# EasyEDA Pro project MAX5864_REUSE.eprj, board PCB3
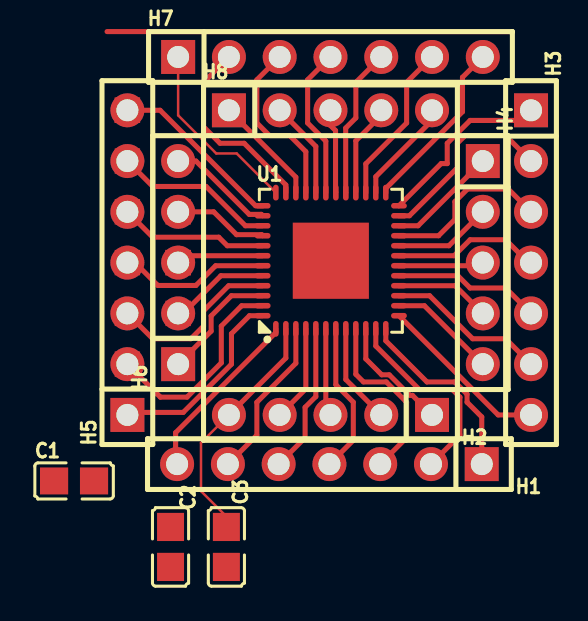
[diagram p8: board, top side]
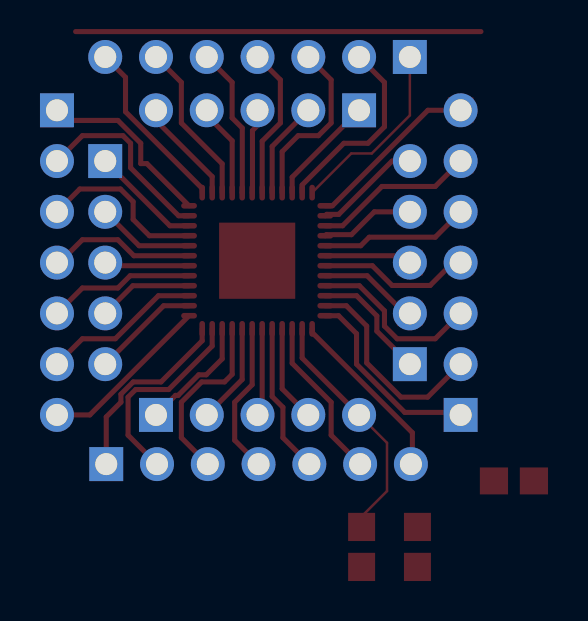
[diagram p9: board, bottom side, seen from below]

No outline. copper layers: Top Layer, Bottom Layer. Coordinates in mm from the lowest, leftmost part position.
Stack: Top Layer 0.035mm / Dielectric1 1.51mm FR4 er 4.5 / Bottom Layer 0.035mm

## Design rules (mm)
template: JLCPCB Capability(Two Layers Board)
spacing copperThickness1oz (default): track to track 0.102, other pairs 0.152 to 0.3
spacing copperThickness2oz: track to track 0.203, other pairs 0.152 to 0.3
track width copperThickness1oz (default): min 0.127, default 0.254, max 2.54
track width copperThickness2oz: min 0.203, default 0.254, max 2.54
differential pair differentialPair (default): width min 0.127, default 0.254, max 2.54; gap min 0.152, default 0.152
via viaSize (default): diameter min 0.5, default 0.61, max 10; hole min 0.3, default 0.305, max 6.3

## Placement (name value [footprint] x y rotation side)
C1  .33uF  [C0805]  0 3.3 0 top
C2  2.2u  [C0805]  4.83 0 270 top
C3  .1u  [C0805]  7.62 0 270 top
H1  -  [HDR-TH_7P-P2.54-V-M]  12.78 4.14 180 top
H2  -  [HDR-TH_5P-P2.54-V-M]  12.83 6.6 180 top
H3  -  [HDR-TH_7P-P2.54-V-M]  22.86 14.22 270 top
H4  -  [HDR-TH_5P-P2.54-V-M]  20.45 14.22 270 top
H5  -  [HDR-TH_7P-P2.54-V-M]  2.67 14.22 90 top
H6  -  [HDR-TH_5P-P2.54-V-M]  5.21 14.22 90 top
H7  -  [HDR-TH_7P-P2.54-V-M]  12.83 24.51 0 top
H8  -  [HDR-TH_5P-P2.54-V-M]  12.83 21.84 0 top
NOREF  -  [Pad_e391]  5.21 14.22 0 top
NOREF#2  -  [Pad_e380]  2.67 21.84 0 top
NOREF#3  -  [Pad_e382]  2.67 21.84 0 top
NOREF#4  -  [Pad_e387]  2.67 9.14 0 top
NOREF#5  -  [Pad_e383]  2.67 19.3 0 top
NOREF#6  -  [Pad_e384]  2.67 16.76 0 top
NOREF#7  -  [Pad_e388]  2.67 6.6 0 top
NOREF#8  -  [Pad_e392]  5.21 16.76 0 top
NOREF#9  -  [Pad_e385]  2.67 14.22 0 top
NOREF#10  -  [Pad_e389]  5.21 9.14 0 top
NOREF#11  -  [Pad_e386]  2.67 11.68 0 top
NOREF#12  -  [Pad_e390]  5.21 11.68 0 top
NOREF#13  -  [Pad_e381]  5.21 14.22 0 top
U1  MAX5864ETM+T  [qfn-48_l7.0-w7.0-p0.50-bl-ep5.6]  12.84 14.32 0 top

## Footprints (pads in the part's own frame, mm; a bottom-side part is the same pattern mirrored in y, then rotated)
C0805
  rect 1.41x1.35 smd: 1(-1,0) 2(1,0)
HDR-TH_5P-P2.54-V-M
  rect 1.7x1.7 hole 1.1: 1(-5.08,0)
  round 1.7 hole 1.1: 2(-2.54,0) 3(0,0) 4(2.54,0) 5(5.08,0)
HDR-TH_7P-P2.54-V-M
  rect 1.7x1.7 hole 1.1: 1(-7.62,0)
  round 1.7 hole 1.1: 2(-5.08,0) 3(-2.54,0) 4(0,0) 5(2.54,0) 6(5.08,0) 7(7.62,0)
Pad_e380
  rect 1.27x1.27 smd: 50(0,0)
Pad_e381
  rect 1.27x1.27 smd: 50(0,0)
Pad_e382
  rect 1.27x1.27 smd: 51(0,0)
Pad_e383
  rect 1.27x1.27 smd: 52(0,0)
Pad_e384
  rect 1.27x1.27 smd: 53(0,0)
Pad_e385
  rect 1.27x1.27 smd: 54(0,0)
Pad_e386
  rect 1.27x1.27 smd: 55(0,0)
Pad_e387
  rect 1.27x1.27 smd: 56(0,0)
Pad_e388
  rect 1.27x1.27 smd: 57(0,0)
Pad_e389
  rect 1.27x1.27 smd: 58(0,0)
Pad_e390
  rect 1.27x1.27 smd: 59(0,0)
Pad_e391
  rect 1.27x1.27 smd: 60(0,0)
Pad_e392
  rect 1.27x1.27 smd: 61(0,0)
qfn-48_l7.0-w7.0-p0.50-bl-ep5.6
  oval 0.28x0.79 smd: 1(-2.75,-3.408) 2(-2.25,-3.408) 3(-1.75,-3.408) 4(-1.25,-3.408) 5(-0.75,-3.408) 6(-0.25,-3.408) 7(0.25,-3.408) 8(0.75,-3.408) 9(1.25,-3.408) 10(1.75,-3.408) 11(2.25,-3.408) 12(2.75,-3.408) 25(2.75,3.408) 26(2.25,3.408) 27(1.75,3.408) 28(1.25,3.408) 29(0.75,3.408) 30(0.25,3.408) 31(-0.25,3.408) 32(-0.75,3.408) 33(-1.25,3.408) 34(-1.75,3.408) 35(-2.25,3.408) 36(-2.75,3.408)
  oval 0.79x0.28 smd: 13(3.408,-2.75) 14(3.408,-2.25) 15(3.408,-1.75) 16(3.408,-1.25) 17(3.408,-0.75) 18(3.408,-0.25) 19(3.408,0.25) 20(3.408,0.75) 21(3.408,1.25) 22(3.408,1.75) 23(3.408,2.25) 24(3.408,2.75) 37(-3.408,2.75) 38(-3.408,2.25) 39(-3.408,1.75) 40(-3.408,1.25) 41(-3.408,0.75) 42(-3.408,0.25) 43(-3.408,-0.25) 44(-3.408,-0.75) 45(-3.408,-1.25) 46(-3.408,-1.75) 47(-3.408,-2.25) 48(-3.408,-2.75)
  rect 3.81x3.81 smd: 49(0,0)

## Nets
0VDD: H4.3 U1.18
GND: C1.1 C2.2 C3.2 H1.1 H1.4 H1.5 H5.7 H6.3 NOREF.60 NOREF#2.50 NOREF#3.51 NOREF#13.50 U1.5 U1.7 U1.12 U1.37 U1.42 U1.49
VCC: C1.2 H1.7 U1.1
VDD: C2.1 C3.1 H1.2 H2.2 H2.5 H5.4 H5.6 H7.3 NOREF#5.52 NOREF#9.54 U1.2 U1.8 U1.11 U1.33 U1.39 U1.43
CLK: H2.3 U1.6
COM: H5.2 NOREF#4.56 U1.47
CS#: H7.1 U1.36
DA0: H3.7 U1.13
DA1: H4.5 U1.14
DA2: H3.6 U1.15
DA3: H4.4 U1.16
DA4: H3.4 U1.19
DA5: H4.2 U1.20
DA6: H3.3 U1.21
DA7: H4.1 U1.22
DD0: H3.2 U1.23
DD1: H3.1 U1.24
DD2: H7.7 U1.25
DD3: H8.5 U1.26
DD4: H7.6 U1.27
DD5: H8.4 U1.28
DD6: H7.5 U1.29
DD7: H8.3 U1.30
DD8: H7.4 U1.31
DD9: H8.2 U1.32
DIN: H8.1 U1.34
IA+: H1.6 U1.3
IA-: H2.4 U1.4
ID+: H5.3 NOREF#11.55 U1.45
ID_: H6.2 NOREF#12.59 U1.44
NC: H6.5 U1.38
OGND: H3.5 U1.17
QA+: H2.1 U1.10
QA-: H1.3 U1.9
QD+: H6.4 NOREF#8.61 U1.40
QD-: H5.5 NOREF#6.53 U1.41
REFIN: H6.1 NOREF#10.58 U1.46
REFN: H5.1 NOREF#7.57 U1.48
SCLK: H7.2 U1.35

## Routing (per net, layer and track width the routed paths; a pad name or vN(x,y) marks a point on that pad's centre or on a via; arc(x,y) is an arc through that point)
0VDD: length 4.3
  Top Layer w0.254: H4.3 20.29,14.07 U1.18
GND: length 37.9
  Top Layer w0.254: NOREF.60 5.55,14.57 U1.42 ; NOREF#2.50 4.3,21.84 9.08,17.07 U1.37 ; U1.7 13.09,8.11 13.97,7.24 13.97,5.34 H1.4 ; H1.1 20.4,6.5 19.66,7.24 19.66,7.64 19.05,8.25 17.65,8.25 15.59,10.31 U1.12 ; U1.5 12.09,7.52 11.56,6.98 11.56,5.47 H1.5
VCC: length 8.9
  Top Layer w0.254: U1.1 10.09,10.73 5.08,5.72 5.08,4.22 H1.7
VDD: length 51.9
  Top Layer w0.127: H2.5 6.35,5.21 6.35,2.79 7.62,1.52 C3.1
  Top Layer w0.254: U1.43 7.08,14.07 6.1,13.08 4.19,13.08 3.05,14.22 NOREF#9.54 ; U1.33 11.59,19.77 10.8,20.57 9.78,20.57 9.14,21.21 9.14,23.37 H7.3 ; U1.2 10.59,9.45 H2.5 ; U1.39 8.57,16.07 6.6,18.03 3.94,18.03 NOREF#5.52 ; H1.2 19.3,5.59 19.3,7.49 18.92,7.87 17.27,7.87 15.09,10.05 U1.11 ; U1.8 13.59,8.38 H2.2
CLK: length 4.4
  Top Layer w0.254: U1.6 12.59,6.84 H2.3
COM: length 10.4
  Top Layer w0.254: U1.47 8.38,12.07 7.37,11.05 7.37,9.21 5.65,7.49 4.32,7.49 NOREF#4.56
CS#: length 9.4
  Top Layer w0.127: U1.36 8.13,19.69 7.11,19.69 5.21,21.59 H7.1
DA0: length 8.7
  Top Layer w0.254: H3.7 21.22,6.6 U1.13
DA1: length 5.4
  Top Layer w0.254: H4.5 17.52,12.07 U1.14
DA2: length 8
  Top Layer w0.254: H3.6 21.59,10.41 19.94,10.41 17.79,12.57 U1.15
DA3: length 4.8
  Top Layer w0.254: H4.4 19.06,13.07 U1.16
DA4: length 7.4
  Top Layer w0.254: U1.19 19.01,14.57 19.81,15.37 21.59,15.37 22.73,14.22 H3.4
DA5: length 4.9
  Top Layer w0.254: U1.20 18.75,15.07 H4.2
DA6: length 8.6
  Top Layer w0.254: H3.3 21.72,17.91 19.69,17.91 19.05,17.27 19.05,16.38 18.23,15.57 U1.21
DA7: length 5.5
  Top Layer w0.254: H4.1 17.21,16.07 U1.22
DD0: length 9.5
  Top Layer w0.254: H3.2 21.59,20.57 19.56,20.57 19.18,20.19 19.18,18.97 16.77,16.57 U1.23
DD1: length 9.2
  Top Layer w0.254: H3.1 22.35,21.34 19.81,21.34 18.67,20.19 18.67,19.18 18.36,19.18 U1.24
DD2: length 8.8
  Top Layer w0.254: H7.7 19.43,23.5 19.43,21.77 15.59,17.94 U1.25
DD3: length 5.3
  Top Layer w0.254: H8.5 17.91,21.34 15.09,18.52 U1.26
DD4: length 8.2
  Top Layer w0.254: U1.27 14.59,19.17 16.64,21.21 16.64,23.24 H7.6
DD5: length 4.6
  Top Layer w0.254: U1.28 14.09,20.32 15.37,21.59 H8.4
DD6: length 7.5
  Top Layer w0.254: U1.29 13.59,17.73 13.59,20.95 14.1,21.46 14.1,23.24 H7.5
DD7: length 4.2
  Top Layer w0.254: U1.30 13.08,17.74 13.08,20.83 12.83,21.08 H8.3
DD8: length 7.6
  Top Layer w0.254: U1.31 12.59,20.3 11.68,21.21 11.68,23.37 H7.4
DD9: length 4.9
  Top Layer w0.254: H8.2 12.09,20.04 U1.32
DIN: length 5.5
  Top Layer w0.254: H8.1 11.09,18.5 U1.34
IA+: length 8.2
  Top Layer w0.254: U1.3 11.09,9.19 9.14,7.24 9.14,5.59 H1.6
IA-: length 4.8
  Top Layer w0.254: U1.4 11.59,7.91 H2.4
ID+: length 8.8
  Top Layer w0.254: U1.45 7.73,13.07 6.48,11.81 6.48,11.05 5.84,10.41 3.94,10.41 H5.3
ID_: length 5
  Top Layer w0.254: U1.44 7.34,13.57 5.46,11.68 H6.2
NC: length 5.4
  Top Layer w0.254: H6.5 6.1,19.3 8.76,16.64 9.37,16.64 U1.38
OGND: length 7.4
  Top Layer w0.254: H3.5 21.59,12.95 19.81,12.95 19.2,13.57 U1.17
QA+: length 6
  Top Layer w0.254: H2.1 16.93,7.58 16.8,7.58 15.77,8.61 15.39,8.61 14.59,9.41 U1.10
QA-: length 9
  Top Layer w0.254: H1.3 16.64,5.47 16.64,7.24 15.62,8.25 14.48,8.25 14.09,8.64 U1.9
QD+: length 4.7
  Top Layer w0.254: U1.40 9.38,15.62 8.13,15.62 6.99,16.76 NOREF#8.61
QD-: length 7.5
  Top Layer w0.254: U1.41 7.67,15.07 7.24,15.49 3.94,15.49 NOREF#6.53
REFIN: length 6.1
  Top Layer w0.254: U1.46 7.87,12.57 6.86,11.56 6.86,10.79 NOREF#10.58
REFN: length 9.7
  Top Layer w0.254: U1.48 8.77,11.57 7.87,10.67 7.87,9.14 5.46,6.73 2.79,6.73 NOREF#7.57
SCLK: length 9.7
  Top Layer w0.254: H7.2 6.48,23.24 6.48,21.02 7.3,20.19 8.51,20.19 10.59,18.11 U1.35
